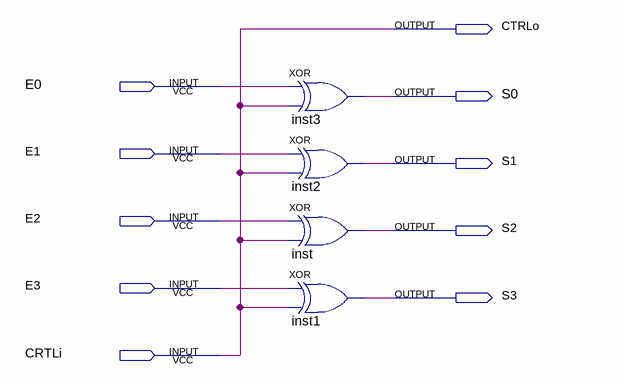
[diagram p0: schematic sheet]
// Quartus schematic Inversor.bdf as structural Verilog: 4 symbols, 10 pins
module Inversor (
  input  E0,
  input  E1,
  input  E2,
  input  E3,
  input  CRTLi,
  output CTRLo,
  output S0,
  output S1,
  output S2,
  output S3
);

  xor inst3 (S0, E0, CRTLi);
  xor inst2 (S1, E1, CRTLi);
  xor inst (S2, E2, CRTLi);
  xor inst1 (S3, E3, CRTLi);

  assign CTRLo = CRTLi;
endmodule
